# Altium schematic sheet Relay Module.SchDoc
size A3; SheetNumber: 1; SheetTotal: 1
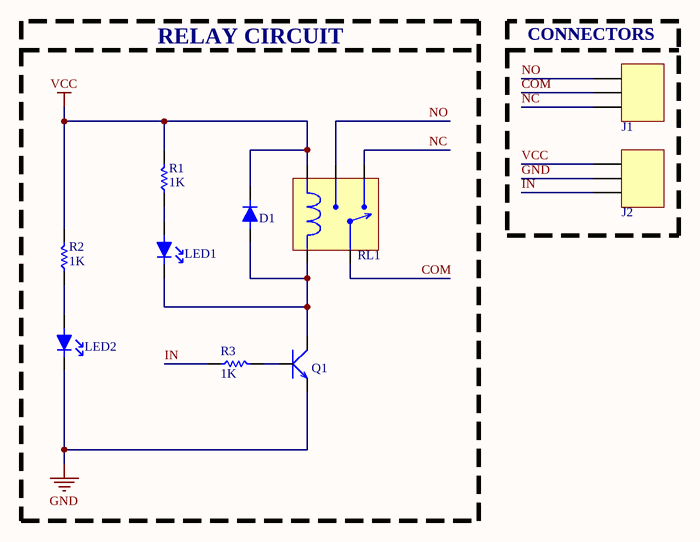
[diagram p0: Relay Module.SchDoc]

## Parts
D1  S1A  [DIODE]  (value not drawn)
J1  OSTTA034163  [connector]  (value not drawn)
J2  61300311121  [HEADER]  (value not drawn)
LED1  151031VS06000  [GREEN LED]  (value not drawn)
LED2  151031SS06000  [RED LED]  (value not drawn)
Q1  PMBT2222A,215  [TRANSISTOR]  (value not drawn)
R1  value 1K  [RES 0805]  (hidden comment: RNCP0805FTD1K00)
R2  value 1K  [RES 0805]  (hidden comment: RNCP0805FTD1K00)
R3  value 1K  [RES 0805]  (hidden comment: RNCP0805FTD1K00)
RL1  G5LE-1 DC5  [RELAY]  (value not drawn)

## Blocks framed on the sheet
RELAY CIRCUIT: D1 LED1 LED2 Q1 R1-R3 RL1

## Nets
GND: J2.2 LED2.2 Q1.2
VCC: D1.2 J2.1 R1.2 R2.2 RL1.2
COM: J1.2 RL1.1
IN: J2.3 R3.1
NC: J1.3 RL1.4
NO: J1.1 RL1.3
NetD1_1: D1.1 LED1.2 Q1.3 RL1.5
NetLED1_1: LED1.1 R1.1
NetLED2_1: LED2.1 R2.1
NetQ1_1: Q1.1 R3.2

## Notes on the sheet
- (near J1) CONNECTORS
- Dosya Adı / File Name
- Hazırlayan / Prepared By
- Tanım / Description
- Değiştirme Tarihi / Changed Date
- Bölüm / Department
- Onaylayan / Approved By
- Kontrol Eden / Checked By
- Boyut / Size
- Sayfa / Sheet
- Revizyon / Revision

## Library data of the parts
D1 = DIODE SMD: DIODE 50V 1A SMD
J1 = CONNECTOR: TERM BLK 3P 5.08MM PCB
J2 = HEADER: CONN HEADER 3POS 2.54MM
LED1 = GREEN LED TH: LED GREEN 3MM TH
LED2 = RED LED TH: LED RED 3MM TH
Q1 = TRANSISTOR: TRANS NPN 30V 0.6A TO236AB
R1-R3 = RES 1K OHM 0805 SMD: RES 1K OHM 1% 1/4W 0805
RL1 = RELAY: RELAY 5VDC COIL 10A